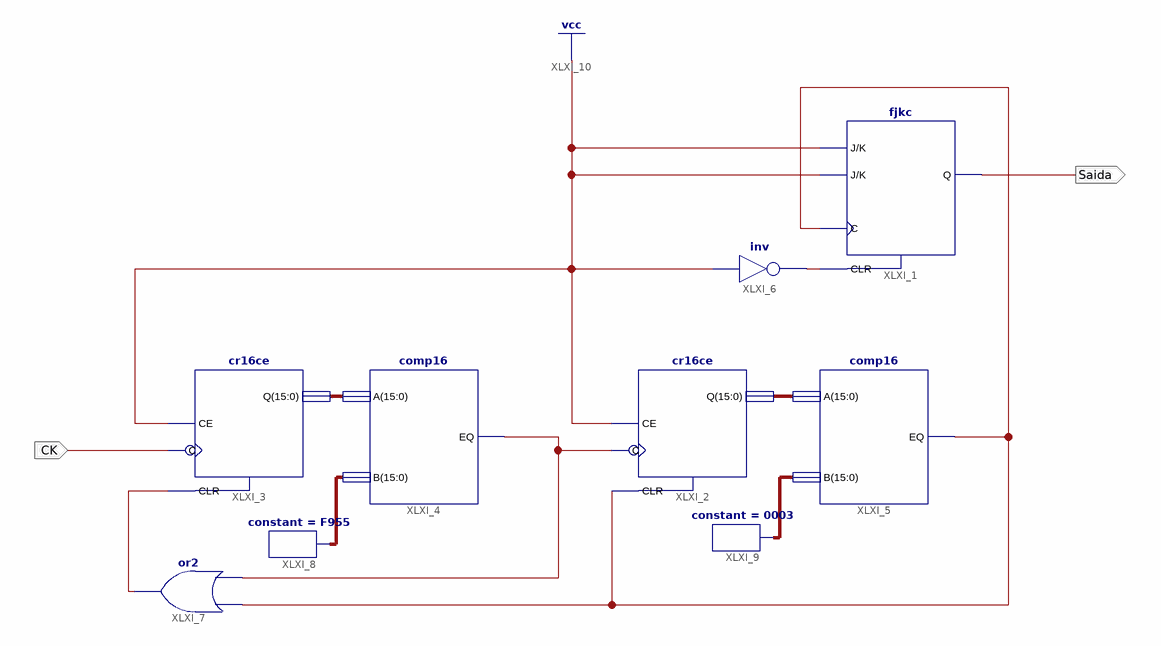
[diagram p0: schematic sheet 1]
// Xilinx ISE schematic Div_Freq_20.sch (spartan3) as structural Verilog: 9 symbols, 2 ports
module Div_Freq_20 (
  input  CK,
  output Saida
);

  wire XLXN_1, XLXN_6, XLXN_8, XLXN_9;
  wire [15:0] XLXN_2, XLXN_3, XLXN_5, XLXN_11;

  fjkc XLXI_1 (.C(XLXN_8), .CLR(XLXN_1), .J(1'b1), .K(1'b1), .Q(Saida));
  cr16ce XLXI_2 (.C(XLXN_6), .CE(1'b1), .CLR(XLXN_8), .Q(XLXN_11));
  cr16ce XLXI_3 (.C(CK), .CE(1'b1), .CLR(XLXN_9), .Q(XLXN_5));
  comp16 XLXI_4 (.A(XLXN_5), .B(XLXN_2), .EQ(XLXN_6));
  comp16 XLXI_5 (.A(XLXN_11), .B(XLXN_3), .EQ(XLXN_8));
  not XLXI_6 (XLXN_1, 1'b1);
  or XLXI_7 (XLXN_9, XLXN_6, XLXN_8);
  constant #(.CValue("F955")) XLXI_8 (.O(XLXN_2));
  constant #(.CValue("0003")) XLXI_9 (.O(XLXN_3));
endmodule
